# Altium schematic sheet Battery_Holder_VNA.SchDoc
size A4; SheetNumber: 1; SheetTotal: 1
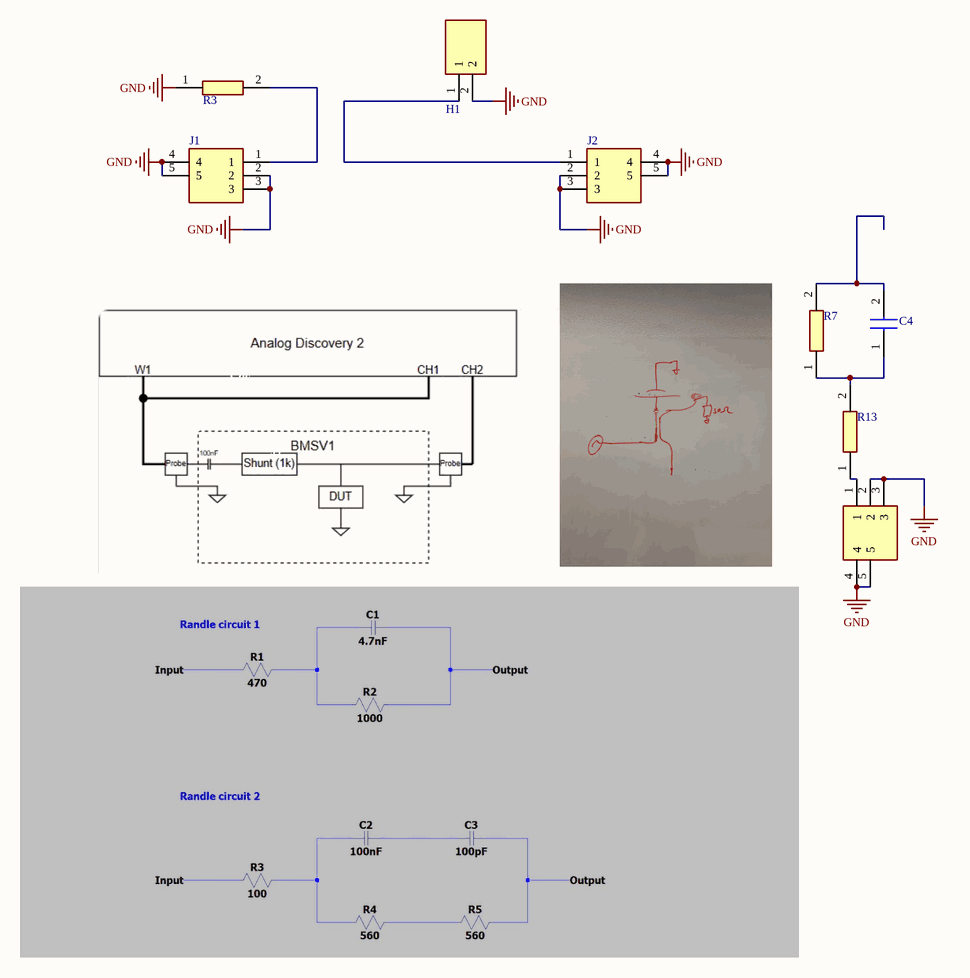
[diagram p0: Battery_Holder_VNA.SchDoc]

## Parts
C4  200A472MT50XT  [CAPC1514X145N]  (value not drawn)
H1  1015  [1015]  (value not drawn)
J1  60311002114501  [60311002114501]  (value not drawn)
J2  60311002114501  [60311002114501]  (value not drawn)
J3  60311002114501  [60311002114501]  (value not drawn)
R3  CH0402-50RGFT  [RESC1006X63N]  (value not drawn)
R7  FC0402E1001DTT5  [RESC1106X42N]  (value not drawn)
R13  CH0402-500RGFPT  [RESC1006X63N]  (value not drawn)

## Nets
GND: H1.2 J1.2 J1.3 J1.4 J1.5 J2.2 J2.3 J2.4 J2.5 J3.2 J3.3 J3.4 J3.5 R3.1
NetC4_1: C4.1 R7.1 R13.2
NetC4_2: C4.2 R7.2
NetH1_1: H1.1 J2.1
NetJ1_1: J1.1 R3.2
NetJ3_1: J3.1 R13.1

## Notes on the sheet
- H1
- R3
- Cdc
- J2
- J1

## Library data of the parts
C4 = 200A472MT50XT: Capacitor; Manufacturer_Name: Kyocera AVX; Datasheet Link: https://datasheets.kyocera-avx.com/200A.pdf; Height: 1.45mm; Manufacturer_Part_Number: 200A472MT50XT
H1 = 1015: Hardware; Manufacturer_Name: Keystone Electronics; Datasheet Link: https://componentsearchengine.com/Datasheets/1/1015.pdf; Manufacturer_Part_Number: 1015; Mouser Part Number: 534-1015; Mouser Price/Stock: https://www.mouser.co.uk/ProductDetail/Keystone-Electronics/1015?qs=73q%2FgRcW4F2OhJTPPQWZpA%3D%3D
J1-J3 = 60311002114501: Connector; Manufacturer_Name: Wurth Elektronik; Datasheet Link: https://www.we-online.com/catalog/datasheet/60311002114501.pdf; Height: 9.66mm; Manufacturer_Part_Number: 60311002114501; Mouser Part Number: 710-60311002114501; Mouser Price/Stock: https://www.mouser.co.uk/ProductDetail/Wurth-Elektronik/60311002114501?qs=3jNSNtuqJTKCM9Xl9ihRQg%3D%3D
R3 = CH0402-50RGFT: Resistor; Manufacturer_Name: Vishay; Datasheet Link: https://www.vishay.com/docs/53014/ch-cha.pdf; Height: 0.627mm; Manufacturer_Part_Number: CH0402-50RGFT; Mouser Part Number: 71-CH0402-50RGFT; Mouser Price/Stock: https://www.mouser.co.uk/ProductDetail/Vishay-Sfernice/CH0402-50RGFT?qs=pwCIrTHziWHsau0e%2F4JCXQ%3D%3D
R7 = FC0402E1001DTT5: Resistor; Manufacturer_Name: Vishay; Datasheet Link: https://www.vishay.com/docs/60093/fcseries.pdf; Height: 0.419mm; Manufacturer_Part_Number: FC0402E1001DTT5; Mouser Part Number: 71-FC0402E1001DTT5; Mouser Price/Stock: https://www.mouser.co.uk/ProductDetail/Vishay-Thin-Film/FC0402E1001DTT5?qs=j%252B1pi9TdxUZDQ%252BI47GWCkg%3D%3D
R13 = CH0402-500RGFPT: Resistor; Manufacturer_Name: Vishay; Datasheet Link: https://componentsearchengine.com/Datasheets/2/CH0402-500RGFPT.pdf; Height: 0.627mm; Manufacturer_Part_Number: CH0402-500RGFPT; Mouser Part Number: 71-CH0402-500RGFPT; Mouser Price/Stock: https://www.mouser.co.uk/ProductDetail/Vishay-Sfernice/CH0402-500RGFPT?qs=viaqaOk9TMQvbMBtnMpE1w%3D%3D